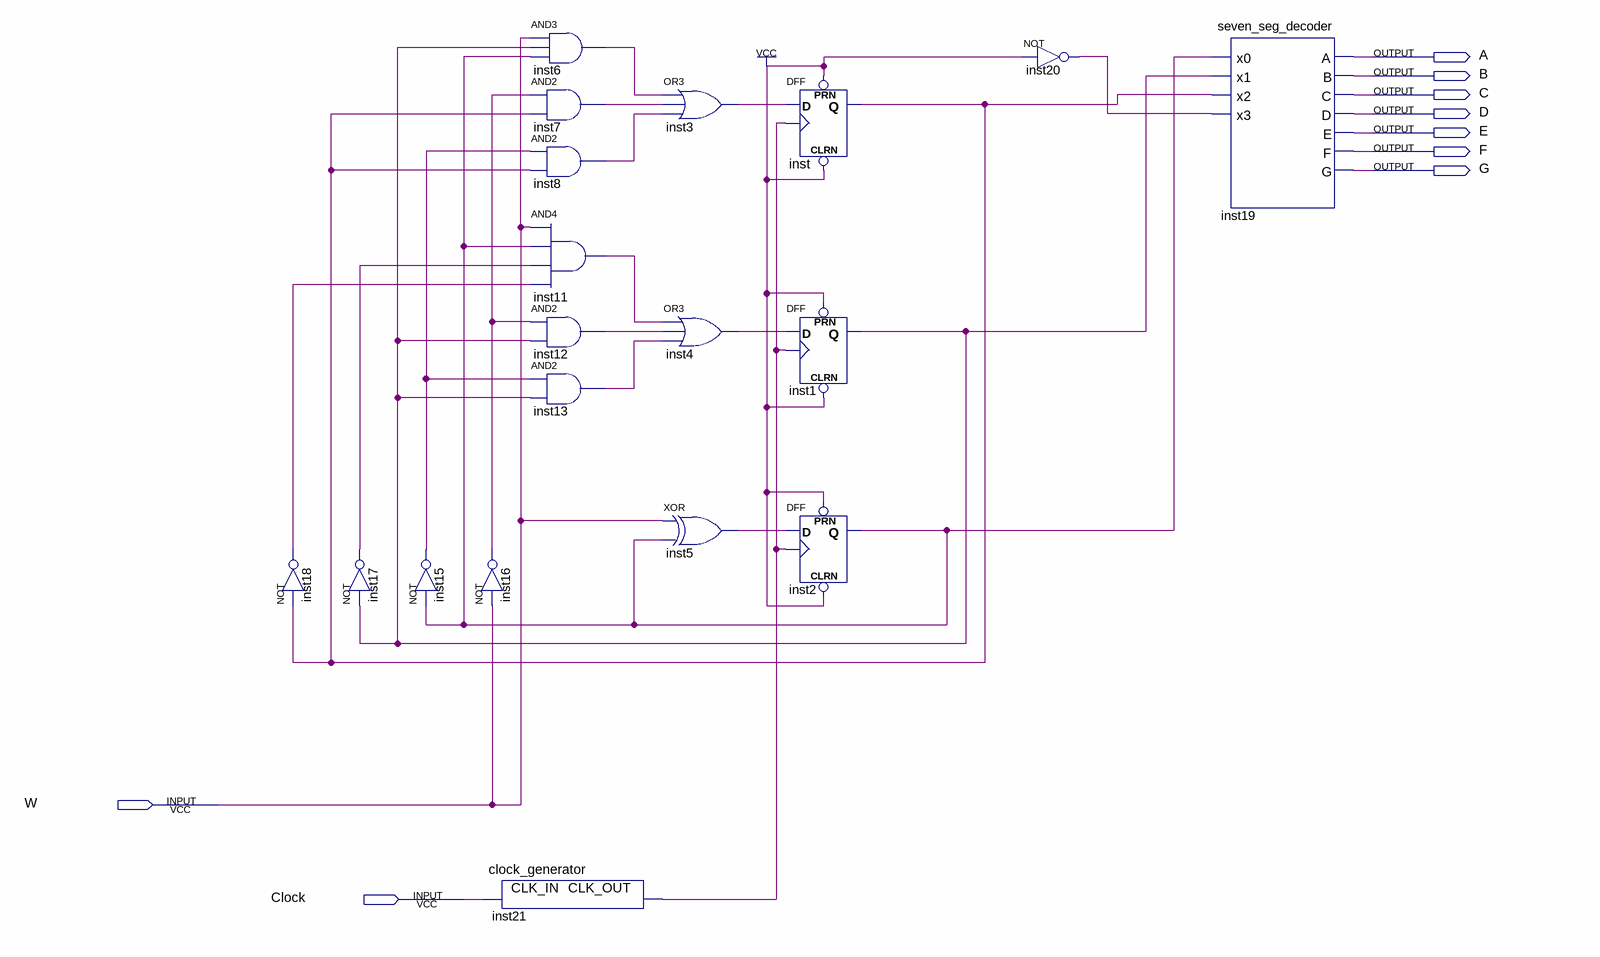
[diagram p0: schematic sheet]
// Quartus schematic lab11step1.bdf as structural Verilog: 19 symbols, 9 pins
module lab11step1 (
  input  W,
  input  Clock,
  output A,
  output B,
  output C,
  output D,
  output E,
  output F,
  output G
);

  wire inst1_q, inst2_q, inst3_out, inst4_out, inst5_out, inst6_out, inst7_out, inst8_out, inst11_out,
       inst12_out, inst13_out, inst15_out, inst16_out, inst17_out, inst18_out, inst20_out, inst21_clk_out,
       inst_q;

  not inst18 (inst18_out, inst_q);
  not inst17 (inst17_out, inst1_q);
  not inst15 (inst15_out, inst2_q);
  not inst16 (inst16_out, W);
  clock_generator inst21 (.CLK_IN(Clock), .CLK_OUT(inst21_clk_out));
  and inst6 (inst6_out, W, inst1_q, inst2_q);
  and inst7 (inst7_out, inst16_out, inst_q);
  and inst8 (inst8_out, inst15_out, inst_q);
  and inst11 (inst11_out, W, inst2_q, inst17_out, inst18_out);
  and inst12 (inst12_out, inst16_out, inst1_q);
  and inst13 (inst13_out, inst15_out, inst1_q);
  or inst3 (inst3_out, inst6_out, inst7_out, inst8_out);
  or inst4 (inst4_out, inst11_out, inst12_out, inst13_out);
  xor inst5 (inst5_out, W, inst2_q);
  DFF inst (.CLRN(1'b1), .CLK(inst21_clk_out), .D(inst3_out), .PRN(1'b1), .Q(inst_q));
  DFF inst1 (.CLRN(1'b1), .CLK(inst21_clk_out), .D(inst4_out), .PRN(1'b1), .Q(inst1_q));
  DFF inst2 (.CLRN(1'b1), .CLK(inst21_clk_out), .D(inst5_out), .PRN(1'b1), .Q(inst2_q));
  not inst20 (inst20_out, 1'b1);
  seven_seg_decoder inst19 (
    .x0(inst2_q), .x1(inst1_q), .x2(inst_q), .x3(inst20_out), .A(A), .B(B), .C(C), .D(D), .E(E), .F(F), .G(G));
endmodule
